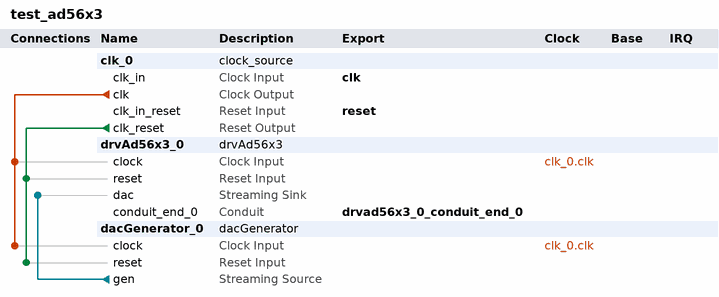
[diagram p0: system contents]
# Platform Designer (Qsys) system test_ad56x3, Cyclone V 5CSEBA6U19A7
# Parameters at their usual value, and those the tool derives, are not listed.
package require -exact qsys 18.1
create_system test_ad56x3
set_project_property DEVICE_FAMILY {Cyclone V}
set_project_property DEVICE 5CSEBA6U19A7

add_instance clk_0 clock_source 18.1
set_instance_parameter_value clk_0 clockFrequency 50000000

add_instance drvAd56x3_0 drvAd56x3 1.0
set_instance_parameter_value drvAd56x3_0 DATA_WIDTH 14
set_instance_parameter_value drvAd56x3_0 SCLK_DIVIDER 2
set_instance_parameter_value drvAd56x3_0 SIGN_A UNSIGNED
set_instance_parameter_value drvAd56x3_0 SIGN_B UNSIGNED
set_instance_parameter_value drvAd56x3_0 SYNC_DURATION 5

add_instance dacGenerator_0 dacGenerator 1.0
set_instance_parameter_value dacGenerator_0 DATA_WIDTH 14
set_instance_parameter_value dacGenerator_0 INCREASE_RATE 1
set_instance_parameter_value dacGenerator_0 SIGN_A UNSIGNED
set_instance_parameter_value dacGenerator_0 SIGN_B UNSIGNED

# connections
add_connection clk_0.clk dacGenerator_0.clock clock
add_connection clk_0.clk drvAd56x3_0.clock clock
add_connection clk_0.clk_reset dacGenerator_0.reset reset
add_connection clk_0.clk_reset drvAd56x3_0.reset reset
add_connection dacGenerator_0.gen drvAd56x3_0.dac avalon_streaming

# exported interfaces
add_interface clk clock sink
set_interface_property clk EXPORT_OF clk_0.clk_in
add_interface drvad56x3_0_conduit_end_0 conduit end
set_interface_property drvad56x3_0_conduit_end_0 EXPORT_OF drvAd56x3_0.conduit_end_0
add_interface reset reset sink
set_interface_property reset EXPORT_OF clk_0.clk_in_reset

set_interconnect_requirement {$system} qsys_mm.clockCrossingAdapter HANDSHAKE
set_interconnect_requirement {$system} qsys_mm.enableEccProtection FALSE
set_interconnect_requirement {$system} qsys_mm.insertDefaultSlave FALSE
set_interconnect_requirement {$system} qsys_mm.maxAdditionalLatency 1

save_system test_ad56x3.qsys
